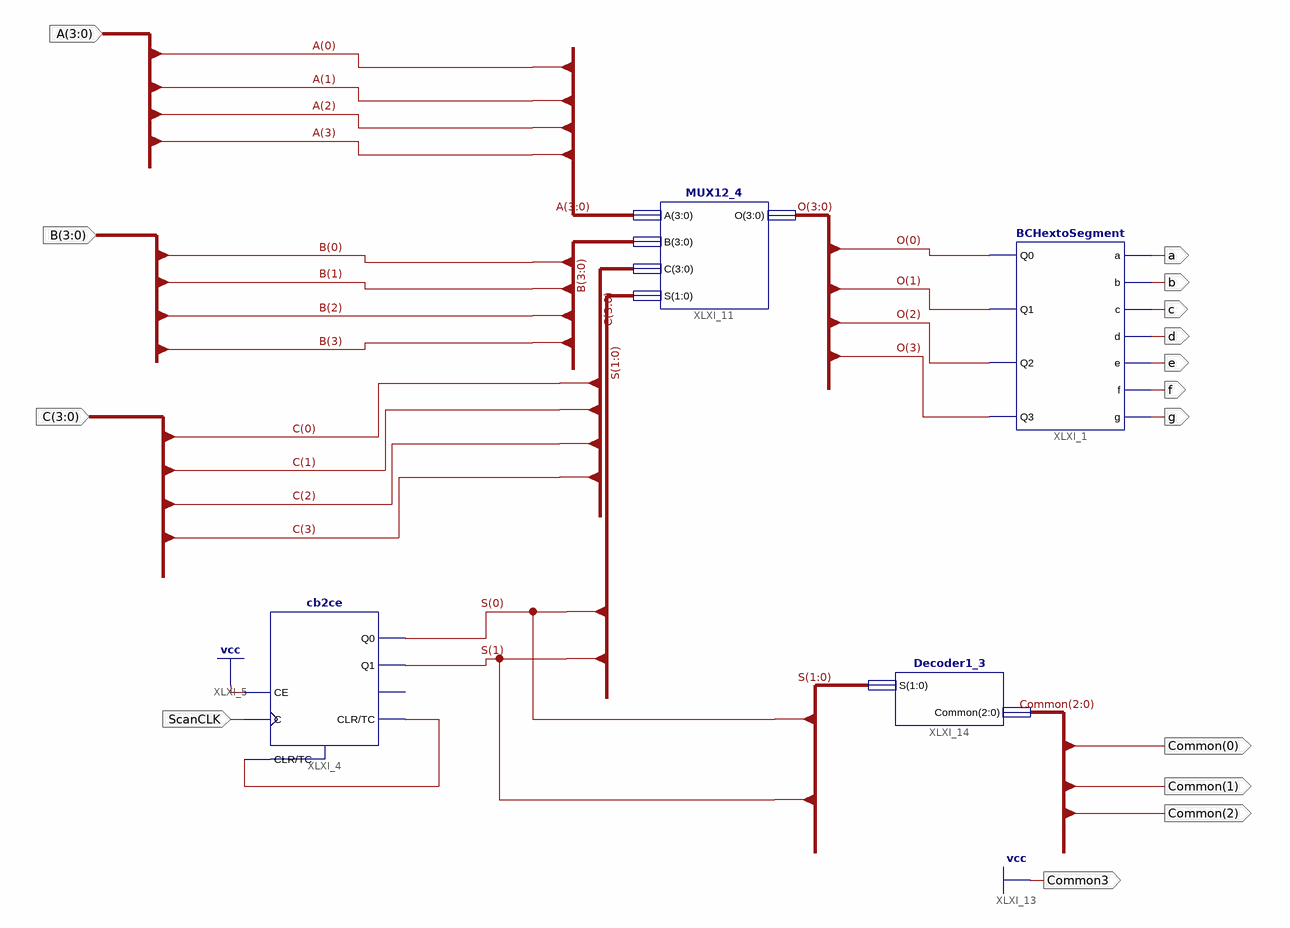
[diagram p0: schematic sheet 1]
// Xilinx ISE schematic Display.sch (spartan6) as structural Verilog: 4 symbols, 15 ports
module Display (
  input  [3:0] A,
  input  [3:0] B,
  input  [3:0] c,
  input  ScanCLK,
  output A_1bit,
  output B_1bit,
  output c_1bit,
  output d,
  output e,
  output f,
  output g,
  output Common3,
  output [2:0] Common
);

  wire XLXN_80;
  wire [1:0] S;
  wire [3:0] O;

  MUX12_4 XLXI_11 (.A(A), .B(B), .C(c), .S(S), .O(O));
  BCHextoSegment XLXI_1 (
    .Q0(O[0]), .Q1(O[1]), .Q2(O[2]), .Q3(O[3]), .a(A_1bit), .b(B_1bit), .c(c_1bit), .d(d), .e(e), .f(f), .g(g));
  cb2ce XLXI_4 (.C(ScanCLK), .CE(1'b1), .CLR(XLXN_80), .Q0(S[0]), .Q1(S[1]), .TC(XLXN_80));  // open: CEO
  Decoder1_3 XLXI_14 (.S(S), .Common(Common));

  assign Common3 = 1'b1;
endmodule
